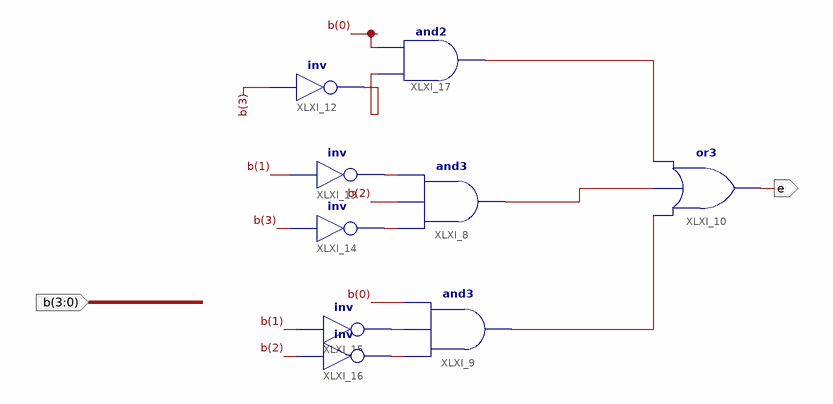
[diagram p0: schematic sheet 1]
// Xilinx ISE schematic e.sch (artix7) as structural Verilog: 9 symbols, 2 ports
module e (
  input  [3:0] b,
  output e
);

  wire XLXN_9, XLXN_10, XLXN_11, XLXN_12, XLXN_13, XLXN_14, XLXN_15, XLXN_16;

  and XLXI_8 (XLXN_14, XLXN_10, b[2], XLXN_9);
  and XLXI_9 (XLXN_15, XLXN_12, XLXN_11, b[0]);
  or XLXI_10 (e, XLXN_15, XLXN_14, XLXN_13);
  not XLXI_12 (XLXN_16, b[3]);
  not XLXI_13 (XLXN_9, b[1]);
  not XLXI_14 (XLXN_10, b[3]);
  not XLXI_15 (XLXN_11, b[1]);
  not XLXI_16 (XLXN_12, b[2]);
  and XLXI_17 (XLXN_13, XLXN_16, b[0]);
endmodule
